# Altium schematic sheet Printhead2.SchDoc: Printhead PCB
size A4; CompanyName: Ultimaker B.V.; DrawnBy: Coen de Boer; Engineer: Coen de Boer; Revision: 2012-K
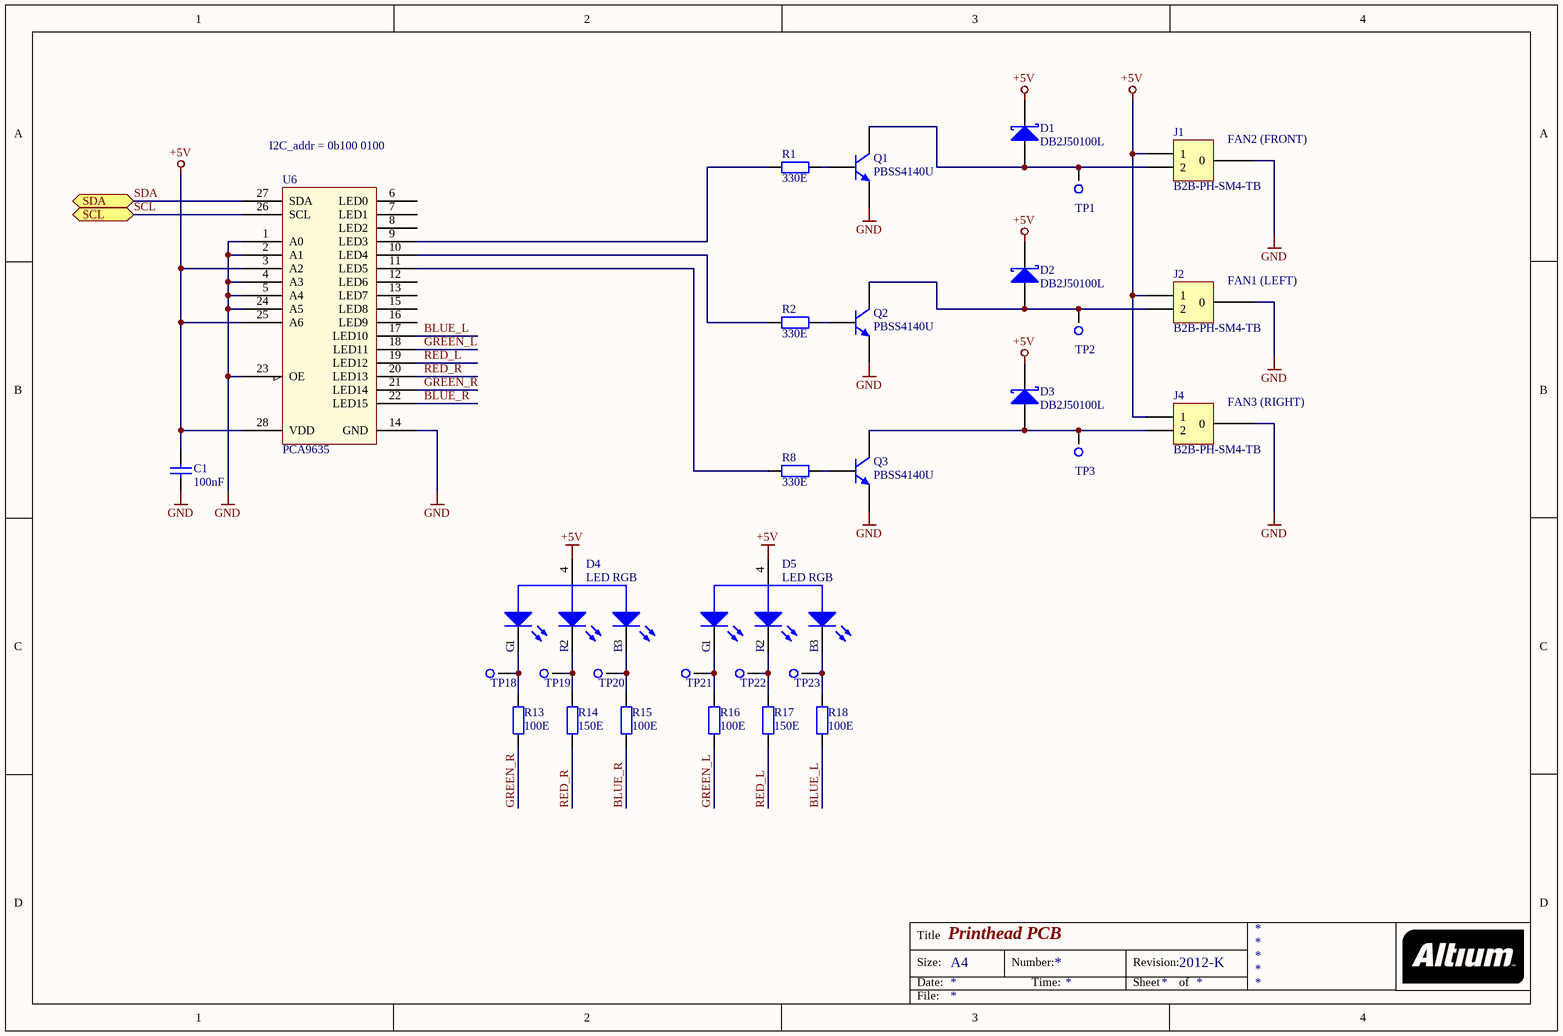
[diagram p0: Printhead2.SchDoc]

## Parts
C1  100nF  [CAPC1608X09N]
D1  DB2J50100L  [SODFL2512X80N]
D2  DB2J50100L  [SODFL2512X80N]
D3  DB2J50100L  [SODFL2512X80N]
D4  LED RGB  [Dialight 598-8610-307F]
D5  LED RGB  [Dialight 598-8610-307F]
J1  B2B-PH-SM4-TB  [B2B-PH-SM4-TB]
J2  B2B-PH-SM4-TB  [B2B-PH-SM4-TB]
J4  B2B-PH-SM4-TB  [B2B-PH-SM4-TB]
Q1  PBSS4140U  [SOT65P210X110-3N]
Q2  PBSS4140U  [SOT65P210X110-3N]
Q3  PBSS4140U  [SOT65P210X110-3N]
R1  330E  [RESC1608X05N]
R2  330E  [RESC1608X05N]
R8  330E  [RESC1608X05N]
R13  100E  [R0805 (2012)]
R14  150E  [R0805 (2012)]
R15  100E  [R0805 (2012)]
R16  100E  [R0805 (2012)]
R17  150E  [R0805 (2012)]
R18  100E  [R0805 (2012)]
TP1  Testpoint 1.6mm  [Testpoint 1.6mm]  (value not drawn)
TP2  Testpoint 1.6mm  [Testpoint 1.6mm]  (value not drawn)
TP3  Testpoint 1.6mm  [Testpoint 1.6mm]  (value not drawn)
TP18  Testpoint 1.6mm  [Testpoint 1.6mm]  (value not drawn)
TP19  Testpoint 1.6mm  [Testpoint 1.6mm]  (value not drawn)
TP20  Testpoint 1.6mm  [Testpoint 1.6mm]  (value not drawn)
TP21  Testpoint 1.6mm  [Testpoint 1.6mm]  (value not drawn)
TP22  Testpoint 1.6mm  [Testpoint 1.6mm]  (value not drawn)
TP23  Testpoint 1.6mm  [Testpoint 1.6mm]  (value not drawn)
U6  PCA9635  [TSOP65P640X110-28N]

## Ports
SCL, SDA

## Nets
+5V: C1.2 D1.1(K) D2.1(K) D3.1(K) D4.4 D5.4 J1.1 J2.1 J4.1 U6.3(A2) U6.25(A6) U6.28(VDD)
GND: C1.1 J1.0 J2.0 J4.0 Q1.2(E) Q2.2(E) Q3.2(E) U6.1(A0) U6.2(A1) U6.4(A3) U6.5(A4) U6.14(GND) U6.23(OE) U6.24(A5)
BLUE_L: R18.1 U6.17(LED10)
BLUE_R: R15.1 U6.22(LED15)
GREEN_L: R16.1 U6.18(LED11)
GREEN_R: R13.1 U6.21(LED14)
RED_L: R17.1 U6.19(LED12)
RED_R: R14.1 U6.20(LED13)
SCL: U6.26(SCL) ; port SCL
SDA: U6.27(SDA) ; port SDA
NetD1_2: D1.2(A) J1.2 Q1.3(C) TP1.1
NetD2_2: D2.2(A) J2.2 Q2.3(C) TP2.1
NetD3_2: D3.2(A) J4.2 Q3.3(C) TP3.1
NetD4_1: D4.1 R13.2 TP18.1
NetD4_2: D4.2 R14.2 TP19.1
NetD4_3: D4.3 R15.2 TP20.1
NetD5_1: D5.1 R16.2 TP21.1
NetD5_2: D5.2 R17.2 TP22.1
NetD5_3: D5.3 R18.2 TP23.1
NetQ1_1: Q1.1(B) R1.2
NetQ2_1: Q2.1(B) R2.2
NetQ3_1: Q3.1(B) R8.2
NetR1_1: R1.1 U6.9(LED3)
NetR2_1: R2.1 U6.10(LED4)
NetR8_1: R8.1 U6.11(LED5)

Not connected (* = marked no-connect by the designer): U6 6(LED0) 7(LED1) 8(LED2) 12(LED6) 13(LED7) 15(LED8) 16(LED9)

## Notes on the sheet
- (near U6) I2C_addr = 0b100 0100
- (near J1) FAN2 (FRONT)
- (near J2) FAN1 (LEFT)
- (near J4) FAN3 (RIGHT)
- Title
- Size:
- Date:
- A4
- Number:
- Time:
- Revision:
- Sheet
- of
- File:
- (in symbol LED 598-8810-307F) G; R; B

## Library data of the parts
C1 = 100nF/50V/0603: CAP CER 0.1UF 50V 10% X7R 0603; Manufacturer: Yageo; Manufacturer Part Number: CC0603KRX7R9BB104; Capacitance: 0.1µF; PackageReference: RAD-0.3; PackageDescription: Radial Cap, Thru-Hole; 2 Leads; 0.3 in Pin Spacing; Value: 100nF; Supplier 1: Digi-Key; RoHS: RoHS Compliant; Category: Capacitors; Stock 1: 1634380; Pricing 1: 1=0.09, 10=0.023, 25=0.0164, 100=0.0106, 250=0.00868, 500=0.00742, 1000=0.00578 (EUR); Voltage - Rated: 50V; Tolerance: ±10%; Temperature Coefficient: X7R; Mounting Type: Surface Mount, MLCC; Operating Temperature: -55°C ~ 125°C; Applications: General Purpose; Ratings: -; Package / Case: 0603 (1608 Metric); Size / Dimension: 0.063" L x 0.031" W (1.60mm x 0.80mm); Height - Seated (Max): -; Thickness (Max): 0.035" (0.90mm); Lead Spacing: -; Features: -; Packaging: Cut Tape (CT); Lead Style: -; ComponentLink1URL: http://www.yageo.com/documents/recent/UPY-GPHC_X7R_6.3V-to-50V_8.pdf; ComponentLink1Description: http://www.yageo.com/documents/recent/UPY-GPHC_X7R_6.3V-to-50V_8.pdf; Supplier Part Number 1: 311-1344-1-ND; Mfg: Yageo; Mfg code: CC0603KRX7R9BB104
D1-D3 = DB2J50100L: DIODE SCHOTTKY 50V 200MA MINI2; Manufacturer: Panasonic Electronic Components - Semiconductor Products; Voltage - Forward (Vf) (Max) @ If: 550mV @ 200mA; Speed: Small Signal =< 200mA (Io), Any Speed; Reverse Recovery Time (trr): 1.6ns; Current - Reverse Leakage @ Vr: 200µA @ 50V; Capacitance @ Vr, F: 4pF @ 10V, 1MHz; Supplier 1: Digi-Key; Supplier Part Number 1: DB2J50100LDKR-ND; Manufacturer Part Number: DB2J50100L; RoHS: RoHS Compliant; Category: Discrete Semiconductor Products; Stock 1: 8821; Pricing 1: 1=0.25, 10=0.222, 25=0.1596, 100=0.1244, 250=0.07816, 500=0.0666, 1000=0.04538 (EUR); Diode Type: Schottky; Voltage - DC Reverse (Vr) (Max): 50V; Current - Average Rectified (Io): 200mA; Mounting Type: Surface Mount; Package / Case: SC-90, SOD-323F; Supplier Device Package: SMini2-F5-B; Packaging: Digi-Reel®; ComponentLink1URL: http://industrial.panasonic.com/www-cgi/jvcr13pz.cgi?E+SC+4+ANE7002+DB2J501+8+WW; ComponentLink1Description: http://industrial.panasonic.com/www-cgi/jvcr13pz.cgi?E+SC+4+ANE7002+DB2J501+8+WW; Mfg: Panasonic Electronic Components - Semiconductor Products; Mfg code: DB2J50100L
D4 D5 = LED 598-8810-307F: LED MULTICOLOR RED/GRN/BLUE; Mfg: Dialight; Mfg code: 598-8610-307F; Supplier: Digikey; Supplier code: 350-2087-2-ND; Manufacturer: Dialight; Manufacturer Part Number: 598-8610-307F
J1 J2 J4 = Header 2: JST B2B-PH-SM4-TB; Mfg: JST; Mfg code: B2B-PH-SM4-TB; Manufacturer: JST; Manufacturer Part Number: B2B-PH-SM4-TB
Q1-Q3 = PBSS4140U: TRANS NPN 40V 1000MA SOT323; Manufacturer: NXP Semiconductors; Manufacturer Part Number: PBSS4140U,115; Current - Collector (Ic) (Max): 1A; Vce Saturation (Max) @ Ib, Ic: 500mV @ 100mA, 1A; Current - Collector Cutoff (Max): 100nA; DC Current Gain (hFE) (Min) @ Ic, Vce: 300 @ 500mA, 5V; Power - Max: 350mW; Frequency - Transition: 150MHz; Supplier 1: Digi-Key; Supplier Part Number 1: 568-6783-6-ND; RoHS: RoHS Compliant; Category: Discrete Semiconductor Products; Stock 1: 3846; Pricing 1: 1=0.4, 10=0.28, 25=0.2304, 100=0.184, 250=0.13404, 500=0.10886, 1000=0.08368 (EUR); Transistor Type: NPN; Voltage - Collector Emitter Breakdown (Max): 40V; Mounting Type: Surface Mount; Package / Case: SC-70, SOT-323; Supplier Device Package: SC-70; Packaging: Digi-Reel®; ComponentLink1URL: http://www.nxp.com/documents/data_sheet/PBSS4140U.pdf; ComponentLink1Description: http://www.nxp.com/documents/data_sheet/PBSS4140U.pdf; Mfg: NXP Semiconductors; Mfg code: PBSS4140U,115
R1 R2 R8 = 330E/0603: RES 330 OHM 1/10W 1% 0603 SMD; Manufacturer: Vishay Dale; Manufacturer Part Number: CRCW0603330RFKEA; VALUE: 10; Resistance (Ohms): 330; Power (Watts): 0.1W, 1/10W; Temperature Coefficient: ±100ppm/°C; Supplier 1: Digi-Key; Supplier Part Number 1: 541-330HDKR-ND; RoHS: RoHS Compliant; Category: Resistors; Stock 1: 34990; Pricing 1: 10=0.069, 50=0.037, 200=0.02135, 1000=0.01454 (EUR); Composition: Thick Film; Features: Automotive AEC-Q200 Qualified; Tolerance: ±1%; Package / Case: 0603 (1608 Metric); Supplier Device Package: 0603 (1608 Metric); Size / Dimension: 0.061" L x 0.033" W (1.55mm x 0.85mm); Height: 0.020" (0.50mm); Number of Terminations: 2; Packaging: Digi-Reel®; ComponentLink1URL: http://www.vishay.com/doc?20035; ComponentLink1Description: http://www.vishay.com/doc?20035; Mfg: Vishay Dale; Mfg code: CRCW0603330RFKEA
R13 R15 R16 R18 = Res 100E 0805: Res 100E 0805 1% 125mW; Faber ItemCode: 31560100; Mfg: YAGEO; Mfg code: WRC31022/ RC0805FR-07100RL; Faber Artikelomschrijving: RES 100E 1% 0,125W 0805; Bestel grote: 5000; Prijs: 0,0009; Max soldering temp: -; Remarks: -; Supplier: Rutronik; Supplier code: WRC31022/ RC0805FR-07100RL; Value: 100E; SMD: Yes; Manufacturer: YAGEO; Manufacturer Part Number: WRC31022/ RC0805FR-07100RL
R14 R17 = Res 150E 0805: Res 150E 0805 1% 125mW; Faber ItemCode: 31224600; Mfg: YAGEO; Mfg code: 2322 734 61501; Faber Artikelomschrijving: RES 150E 1% 0,125W 0805; Bestel grote: 5000; Prijs: 0,0012; Max soldering temp: -; Remarks: -; Supplier: AVNET Abacus; Supplier code: 2322 734 61501; Value: 150E; SMD: Yes; Manufacturer: YAGEO; Manufacturer Part Number: 2322 734 61501
TP1-TP3 TP18-TP23 = Testpoint 1.6mm: ID: Library_MISC-0001; Faber ItemCode: -; Mfg: -; Mfg code: -; Info: Testpoint 1.6mm; Value: Testpoint 1.6mm
U6 = PCA9635: 16-bit Fm+ I2C-bus LED driver; Mfg: NXP; Mfg code: PCA9635PW; Supplier: Farnell; Supplier code: 1854073; Manufacturer: NXP; Manufacturer Part Number: PCA9635PW